# EAGLE schematic CRDC (EAGLE 9.5.1)
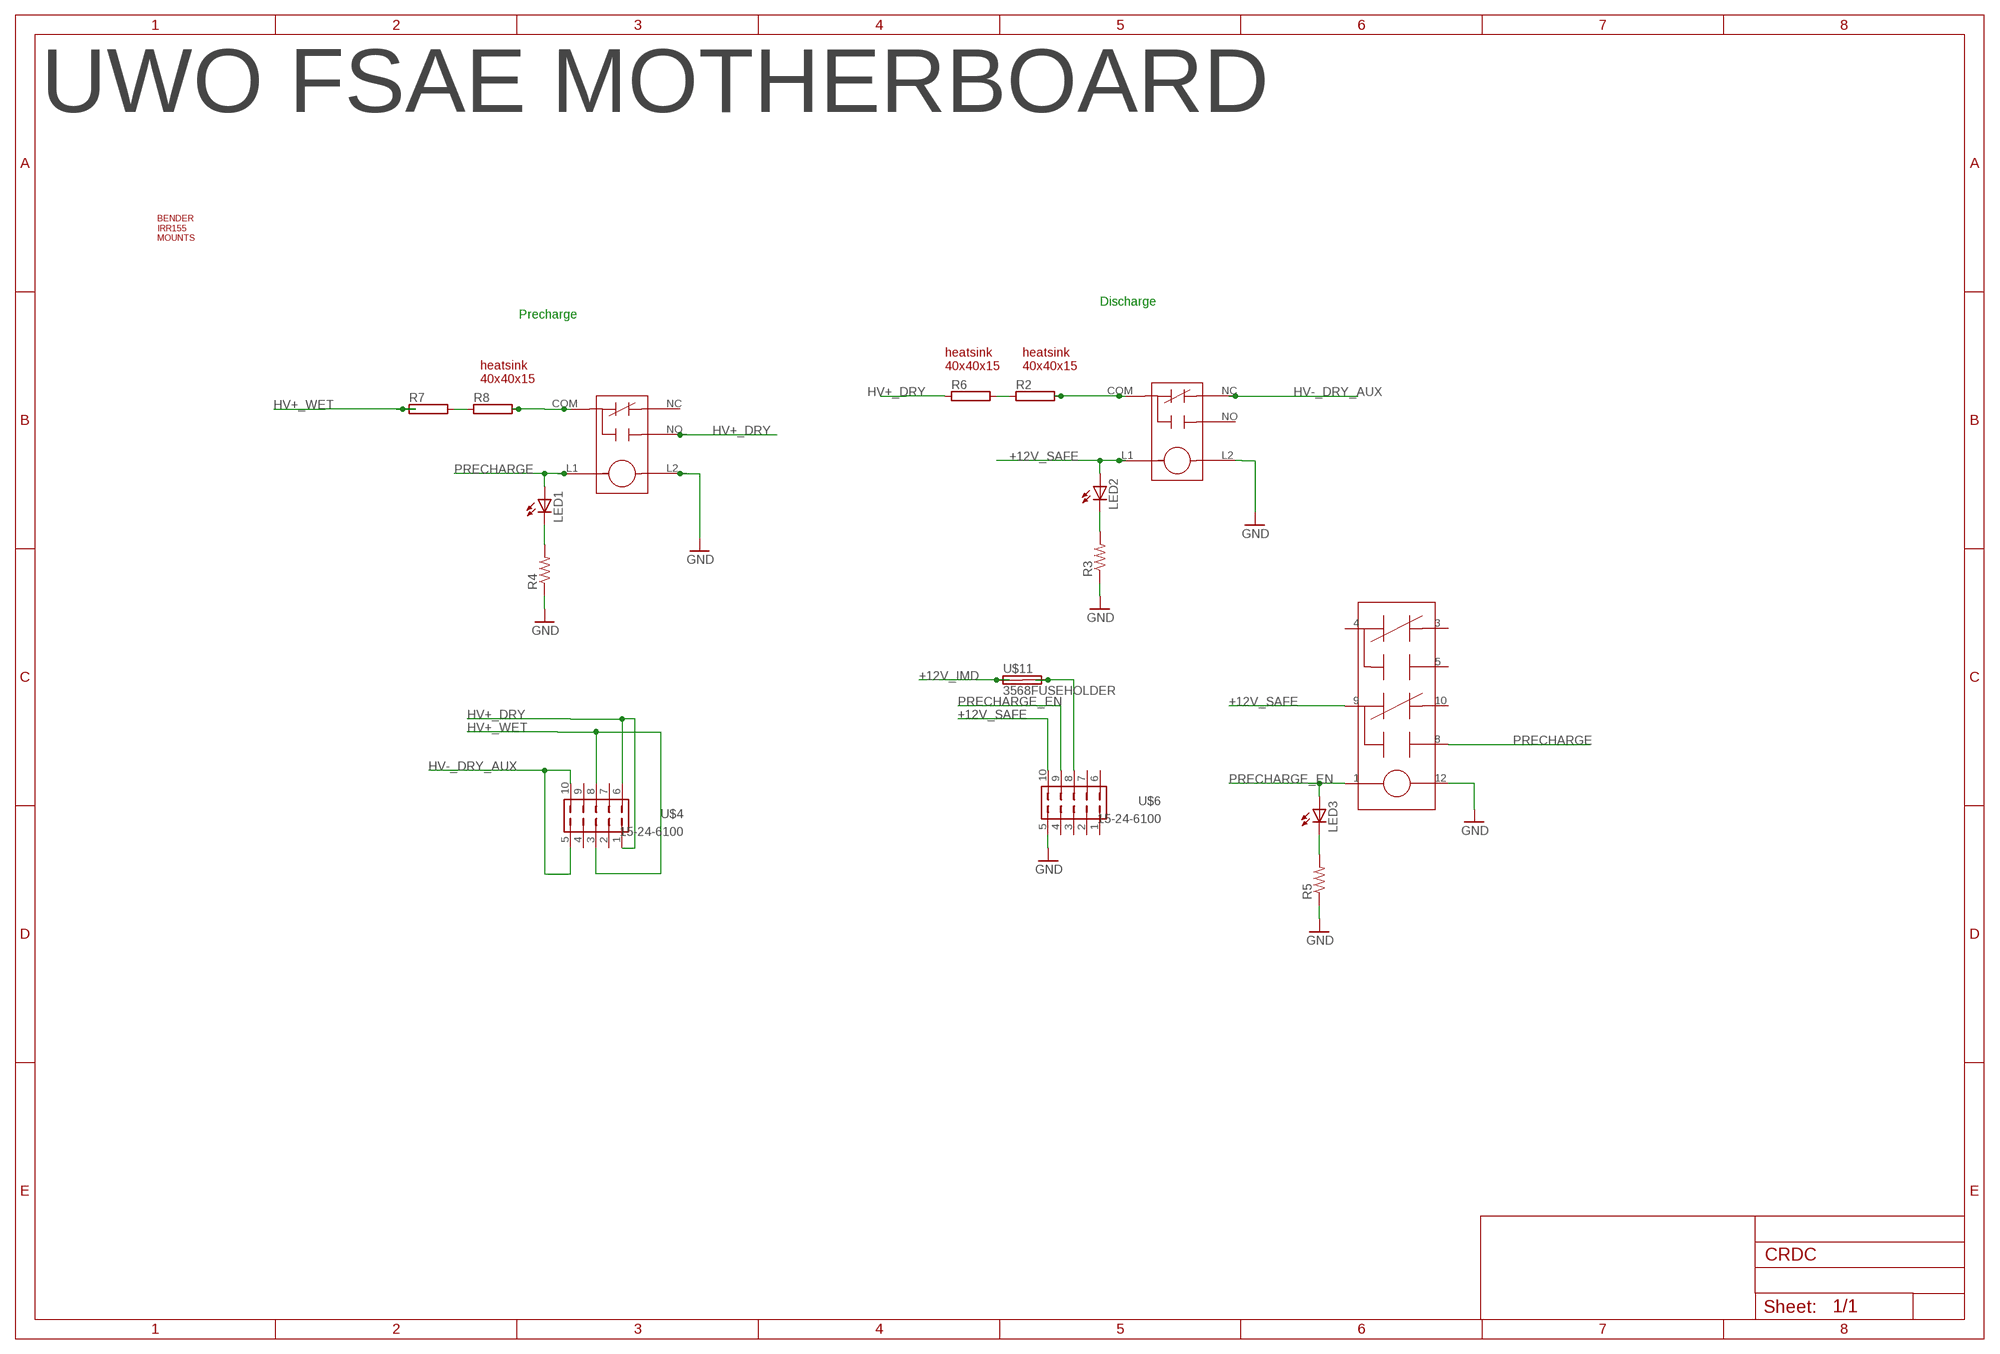
[diagram p0: schematic, sheet 1]

## Parts
LED1  LED3MM  [LED3MM]
LED2  LED3MM  [LED3MM]
LED3  LED3MM  [LED3MM]
R2  RMG100-H  [TO-247-2H]
R3  R-US_R0805  [R0805]
R4  R-US_R0805  [R0805]
R5  R-US_R0805  [R0805]
R6  RMG100-H  [TO-247-2H]
R7  RMG100-H  [TO-247-2H]
R8  RMG100-H  [TO-247-2H]
U$1  G81C335  [G81C335]
U$2  G81C335  [G81C335]
U$4  15-24-6100  [15-24-6100]
U$5  HEATSINK40X40X15  [HEATSINK40X40X15]
U$6  15-24-6100  [15-24-6100]
U$7  V23079B1203B301  [V23079B1203B301]
U$8  HEATSINK40X40X15  [HEATSINK40X40X15]
U$9  HEATSINK40X40X15  [HEATSINK40X40X15]
U$10  BENDER_IRR155  [BENDER_IRR155]
U$11  3568FUSEHOLDER  [3568]

## Nets
+12V_IMD: U$11.L1(1A) U$11.L2(1B)
+12V_SAFE: LED2.A U$2.L1 U$6.10 U$7.9
GND: R3.1 R4.1 R5.1 U$1.L2 U$2.L2 U$6.5 U$7.12
HV+_DRY [HV]: R6.1 U$1.NO U$4.1 U$4.6
HV+_WET [HV]: R7.1 U$4.3 U$4.8
HV-_DRY_AUX [HV]: U$2.NC U$4.5 U$4.10
N$1: LED2.K(C) R3.2
N$2: LED3.K(C) R5.2
N$3: U$6.8 U$11.R1(2A) U$11.R2(2B)
N$4: R2.2 U$2.COM
N$5: LED1.K(C) R4.2
N$6: R2.1 R6.2
N$8: R7.2 R8.1
N$21: R8.2 U$1.COM
PRECHARGE: LED1.A U$1.L1 U$7.8
PRECHARGE_EN: LED3.A U$6.9 U$7.1
Unconnected: U$1.NC U$2.NO U$4.2 U$4.4 U$4.7 U$4.9 U$6.1 U$6.2 U$6.3 U$6.4 U$6.6 U$6.7 U$7.3 U$7.4 U$7.5 U$7.10

## Notes on the sheet
- UWO FSAE MOTHERBOARD
- Discharge
- Precharge

## Library data of the parts
LED1-LED3 = ACC-MB-R0:LED: LED OSRAM: - CHIPLED LG R971, LG N971, LY N971, LG Q971, LY Q971, LO R971, LY R971 LH N974, LH R974 LS Q976, LO Q976, LY Q976 LO Q996 - Hyper CHIPLED LW Q18S LB Q993, LB Q99A, LB R99A - SideLED LS A670, LO A670, LY A670, LG A670, LP A670 LB A673, LV A673, LT A673, LW A673 LH A674 LY A675 LS A676, LA A676, LO A676, LY A676, LW A676 LS A679, LY A679, LG A679 - Hyper Micro SIDELED® LS Y876, LA Y876, LO Y876, LY Y876 LT Y87S - SmartLED LW L88C, LW L88S LB L89C, LB L89S, LG L890 LS L89K, LO L89K, LY L89K LS L896, LA L896, LO L896, LY L896 - TOPLED LS T670, LO T670, LY T670, LG T670, LP T670 LSG T670, LSP T670, LSY T670, LOP T670, LYG T670 LG T671, LOG T671, LSG T671 LB T673, LV T673, LT T673, LW T673 LH T674 LS T676, LA T676, LO T676, LY T676, LB T676, LH T676, LSB T676, LW T676 LB T67C, LV T67C, LT T67C, LS T67K, LO T67K, LY T67K, LW E67C LS E67B, LA E67B, LO E67B, LY E67B, LB E67C, LV E67C, LT E67C LW T67C LS T679, LY T679, LG T679 LS T770, LO T770, LY T770, LG T770, LP T770 LB T773, LV T773, LT T773, LW T773 LH T774 LS E675, LA E675, LY E675, LS T675 LS T776, LA T776, LO T776, LY T776, LB T776 LHGB T686 LT T68C, LB T68C - Hyper Mini TOPLED® LB M676 - Mini TOPLED Santana® LG M470 LS M47K, LO M47K, LY M47K Source: http://www.osram.convergy.de LUXEON: - LUMILED® LXK2-PW12-R00, LXK2-PW12-S00, LXK2-PW14-U00, LXK2-PW14-V00 LXK2-PM12-R00, LXK2-PM12-S00, LXK2-PM14-U00 LXK2-PE12-Q00, LXK2-PE12-R00, LXK2-PE12-S00, LXK2-PE14-T00, LXK2-PE14-U00 LXK2-PB12-K00, LXK2-PB12-L00, LXK2-PB12-M00, LXK2-PB14-N00, LXK2-PB14-P00, LXK2-PB14-Q00 LXK2-PR12-L00, LXK2-PR12-M00, LXK2-PR14-Q00, LXK2-PR14-R00 LXK2-PD12-Q00, LXK2-PD12-R00, LXK2-PD12-S00 LXK2-PH12-R00, LXK2-PH12-S00 LXK2-PL12-P00, LXK2-PL12-Q00, LXK2-PL12-R00 Source: www.luxeon.com KINGBRIGHT: KA-3528ASYC Source: www.kingbright.com
R2 R6-R8 = ACC-MB-R0:RMG100: TO-247 Power Resistor - RMG 100 Series Source: www.token.com.tw .. power-resistor-rmg100pdf; OC_FARNELL: unknown; OC_NEWARK: unknown
R3-R5 = ACC-MB-R0:R-US_: RESISTOR, American symbol; SPICEPREFIX: R
U$1 U$2 = ACC-MB-R0:G81C335
U$4 U$6 = ACC-MB-R0:15-24-6100
U$5 U$8 U$9 = ACC-MB-R0:HEATSINK40X40X15
U$7 = ACC-MB-R0:V23079B1203B301
U$10 = ACC-MB-R0:BENDER_IRR155
U$11 = ACC-MB-R0:3568FUSEHOLDER: 3568 20AMP 500VAC

## Net classes
0 default: width 1 mm, clearance 0.152 mm
1 LV: clearance 0.001 mm
2 HV: clearance 2.5 mm